# EAGLE design Grove - Node v1.0 (EAGLE 7.1.0)

## Sheet 1 of 2
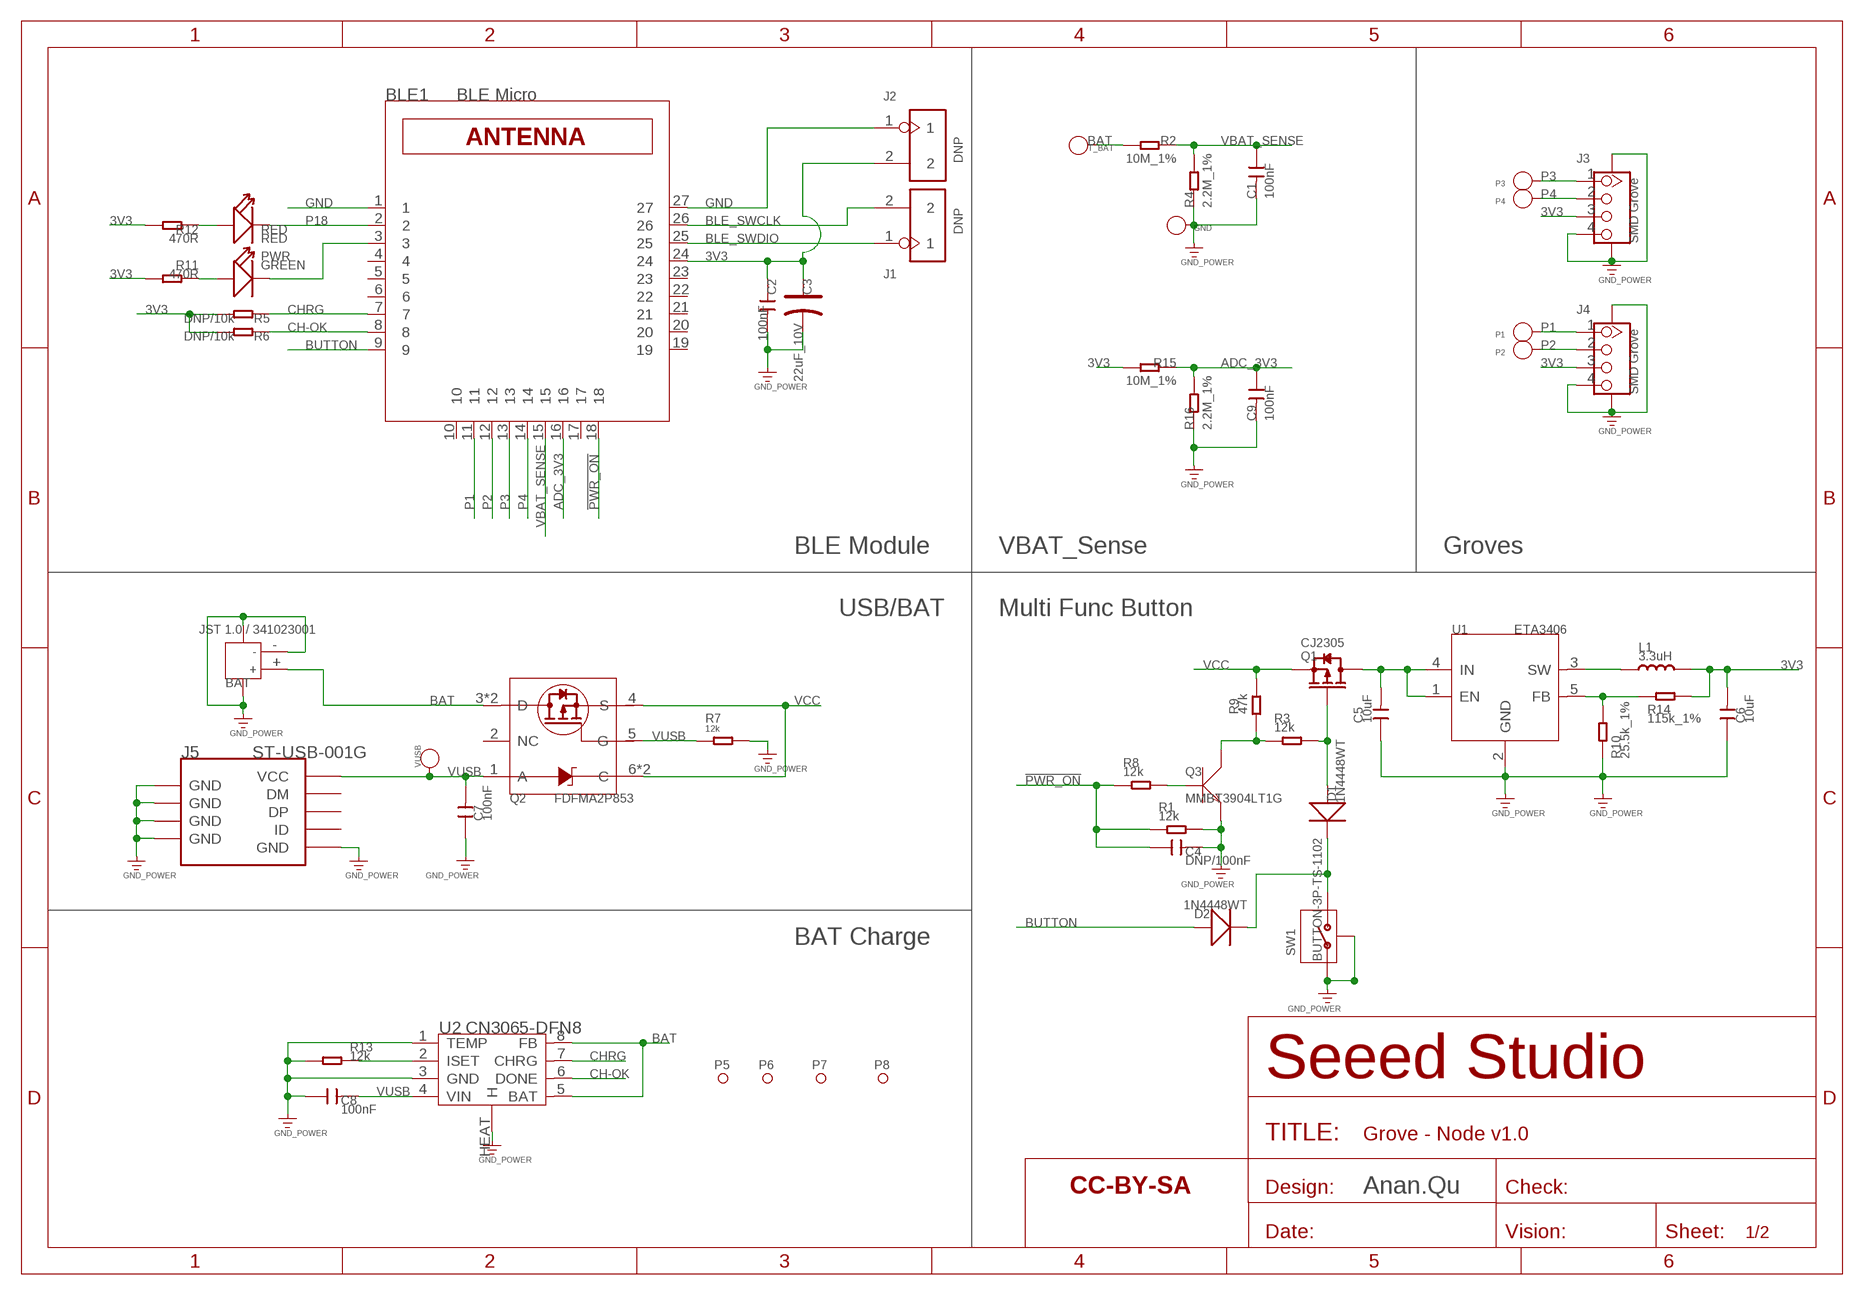
[diagram p0: schematic, sheet 1]

### Parts
BAT  JST 1.0 / 341023001  JACK-JST-2P-SMD-PW'1.0'  [JST-SMD-2P-1.0-90D]
BLE1  BLE Micro  SEEED_BLE_MODULE_001'PAD'  [SEEED_BLE_MODULE_PAD]
C1  100nF  C-0402  [C0402]
C2  100nF  C-0402  [C0402]
C3  22uF_10V  CAP-AVX-A  [AVX-A]
C4  DNP/100nF  C-0402  [C0402]
C5  10uF  C-0805  [C0805]
C6  10uF  C-0805  [C0805]
C7  100nF  C-0402  [C0402]
C8  100nF  C-0402  [C0402]
C9  100nF  C-0402  [C0402]
D1  1N4448WT  D'0603'  [SOD523]
D2  1N4448WT  D'0603'  [SOD523]
GND  PAD-TEST-POINT'4545'  [TP_4545]
J1  DNP  HEADER-2P-2.0  [2P-2.0-55/32MIL]
J2  DNP  HEADER-2P-2.0  [2P-2.0-55/32MIL]
J3  SMD Grove  GROVE-CONNECTOR-SMD'DD'  [4P-SMD-2.0]
J4  SMD Grove  GROVE-CONNECTOR-SMD'DD'  [4P-SMD-2.0]
J5  ST-USB-001G  USB-MINIUSB-5P-MICRO  [MICRO-USB]
L1  3.3uH  L'SLW3015S220MST'  [L3015]
P1  PAD-TEST-POINT'4545'  [TP_4545]
P2  PAD-TEST-POINT'4545'  [TP_4545]
P3  PAD-TEST-POINT'4545'  [TP_4545]
P4  PAD-TEST-POINT'4545'  [TP_4545]
P5  PAD-MARK'ANNULAR'  [ROUND-MARK-1.0]
P6  PAD-MARK'ANNULAR'  [ROUND-MARK-1.0]
P7  PAD-MARK'ANNULAR'  [ROUND-MARK-1.0]
P8  PAD-MARK'ANNULAR'  [ROUND-MARK-1.0]
PWR  GREEN  LED'0402'  [LED-0402]
Q1  CJ2305  MOSFET-P'SI2323CDS/SI2305DS<BR>'  [SOT23]
Q2  FDFMA2P853  [6P-SMD-W/-HEAT]
Q3  MMBT3904LT1G  TRANSISTOR-NPN-SOT23  [SOT-23]
R1  12k  R-0402  [R0402]
R2  10M_1%  R-0402  [R0402]
R3  12k  R-0402  [R0402]
R4  2.2M_1%  R-0402  [R0402]
R5  DNP/10k  R-0402  [R0402]
R6  DNP/10k  R-0402  [R0402]
R7  12k  R-0402  [R0402]
R8  12k  R-0402  [R0402]
R9  47k  R-0402  [R0402]
R10  25.5k_1%  R-0402  [R0402]
R11  470R  R-0402  [R0402]
R12  470R  R-0402  [R0402]
R13  12k  R-0402  [R0402]
R14  115k_1%  R-0402  [R0402]
R15  10M_1%  R-0402  [R0402]
R16  2.2M_1%  R-0402  [R0402]
RED  RED  LED'0402'  [LED-0402]
SW1  BUTTON-3P-TS-1102  [3P-1.5-L4.5*W2.9*H4.5-2.8MM]
T_BAT  PAD-TEST-POINT'4545'  [TP_4545]
U1  ETA3406  [SOT23-5]
U2  CN3065-DFN8  [DFN8]
U$4  SEEEDSTUDIO-OPEN-SCH-FRAME  [SEEEDSTUDIO-PCB-FRAME]
VUSB  PAD-TEST-POINT'4545'  [TP_4545]

### Nets
3V3: BLE1.24 C2.1 C3.+ C6.2 J2.2 J3.3 J4.3 L1.2 R5.2 R6.2 R11.2 R12.2 R14.1 R15.2
!PWR_ON: BLE1.18 C4.1 R1.2 R8.2
ADC_3V3: BLE1.16 C9.1 R15.1 R16.2
BAT: BAT.+ Q2.3(D) Q2.P2(D) R2.2 T_BAT.T U2.5(BAT) U2.8(FB)
BLE_SWCLK: BLE1.26 J1.2
BLE_SWDIO: BLE1.25 J1.1
BUTTON: BLE1.9 D2.+
CH-OK: BLE1.8 R6.1 U2.6(DONE)
CHRG: BLE1.7 R5.1 U2.7(CHRG)
GND: BAT.3 BAT.4 BAT.- BLE1.1 BLE1.27 C1.2 C2.2 C3.- C4.2 C5.1 C6.1 C7.1 C8.1 C9.2 GND.T J2.1 J3.4 J3.SS1 J3.SS2 J4.4 J4.SS1 J4.SS2 J5.5(GND) J5.S1(GND) J5.S2(GND) J5.S3(GND) J5.S4(GND) J5.S5(GND) J5.S6(GND) Q3.2(E) R1.1 R4.1 R7.2 R10.2 R13.1 R16.1 SW1.1 SW1.3(GND) U1.2(GND) U2.1(TEMP) U2.3(GND) U2.HEAT(H) ; supply symbol labelled GND_POWER
ISET: R13.2 U2.2(ISET)
N$1: PWR.+ R11.1
N$2: R12.1 RED.+
N$3: L1.1 U1.3(SW)
N$4: R10.1 R14.2 U1.5(FB)
N$5: Q3.3(C) R3.2 R9.1
N$6: D1.- D2.- SW1.2
N$7: Q3.1(B) R8.1
N$8: C5.2 Q1.3(D) U1.1(EN) U1.4(IN)
N$11: D1.+ Q1.1(G) R3.1
P1: BLE1.11 J4.1 P1.T
P2: BLE1.12 J4.2 P2.T
P3: BLE1.13 J3.1 P3.T
P4: BLE1.14 J3.2 P4.T
P5: BLE1.3 PWR.-
P18: BLE1.2 RED.-
VBAT_SENSE: BLE1.15 C1.1 R2.1 R4.2
VCC: Q1.2(S) Q2.4(S) Q2.6(C) Q2.P1(C) R9.2
VUSB: C7.2 C8.2 J5.1(VCC) Q2.1(A) Q2.5(G) R7.1 U2.4(VIN) VUSB.T
Unconnected: BLE1.4 BLE1.5 BLE1.6 BLE1.10 BLE1.17 BLE1.19 BLE1.20 BLE1.21 BLE1.22 BLE1.23 J5.2(DM) J5.3(DP) J5.4(ID) Q2.2(NC)

### Notes on the sheet
- BLE Module | VBAT_Sense | Groves
- USB/BAT | Multi Func Button
- BAT Charge
- Anan.Qu

## Sheet 2 of 2

## Library data of the parts
BAT = Connector :JACK-JST-2P-SMD-PW
BLE1 = AMLib:SEEED_BLE_MODULE_001
C1 C2 C4-C9 = Discrete:C*: Ceramic Capacitors
C3 = Discrete:CAP*: Electrolytic Capacitors,Tantalum Capacitors and Super Capacitors
D1 D2 = Discrete:D*
GND P1-P4 T_BAT VUSB = Discrete:PAD-TEST-POINT; PARTNO: DNP
J1 J2 = Connector-new:HEADER-2P
J3 J4 = Connector-new:GROVE-CONNECTOR-SMD: 4P-SMD-2.0:320110030;4P-SMD-2.0-90D:320110032
J5 = Connector :USB-MINIUSB-5P
L1 = template:L
P5-P8 = Discrete-new:PAD-MARK; PARTNO: DNP
PWR RED = Discrete:LED*
Q1 = Discrete:MOSFET-P
Q2 = template:FDFMA2P853: Integrated P-Channel Power Trench MOSFET and Schottky Diode
Q3 = Discrete-new:TRANSISTOR-NPN*: NPN audion
R1-R16 = Discrete:R*
SW1 = Discrete-new:BUTTON-3P-TS-1102
U1 = template:ETA3406: 1.5MHZ 1.2A Step-Down Converter in SOT23-5 Package
U2 = IC:CN3065: USB-Compatible Lithiumt-Ion Battery Charger with Thermal Regulation http://www.consonance-elec.com/pdf/%E6%8A%80%E6%9C%AF%E8%AF%B4%E6%98%8E%E4%B9%A6/DSC-CN3065.pdf
U$4 = moudle-new:SEEEDSTUDIO-OPEN-SCH-FRAME

## Net classes
0 default: width 0.102 mm, drill 0.203 mm, clearance 0.102 mm

## Board
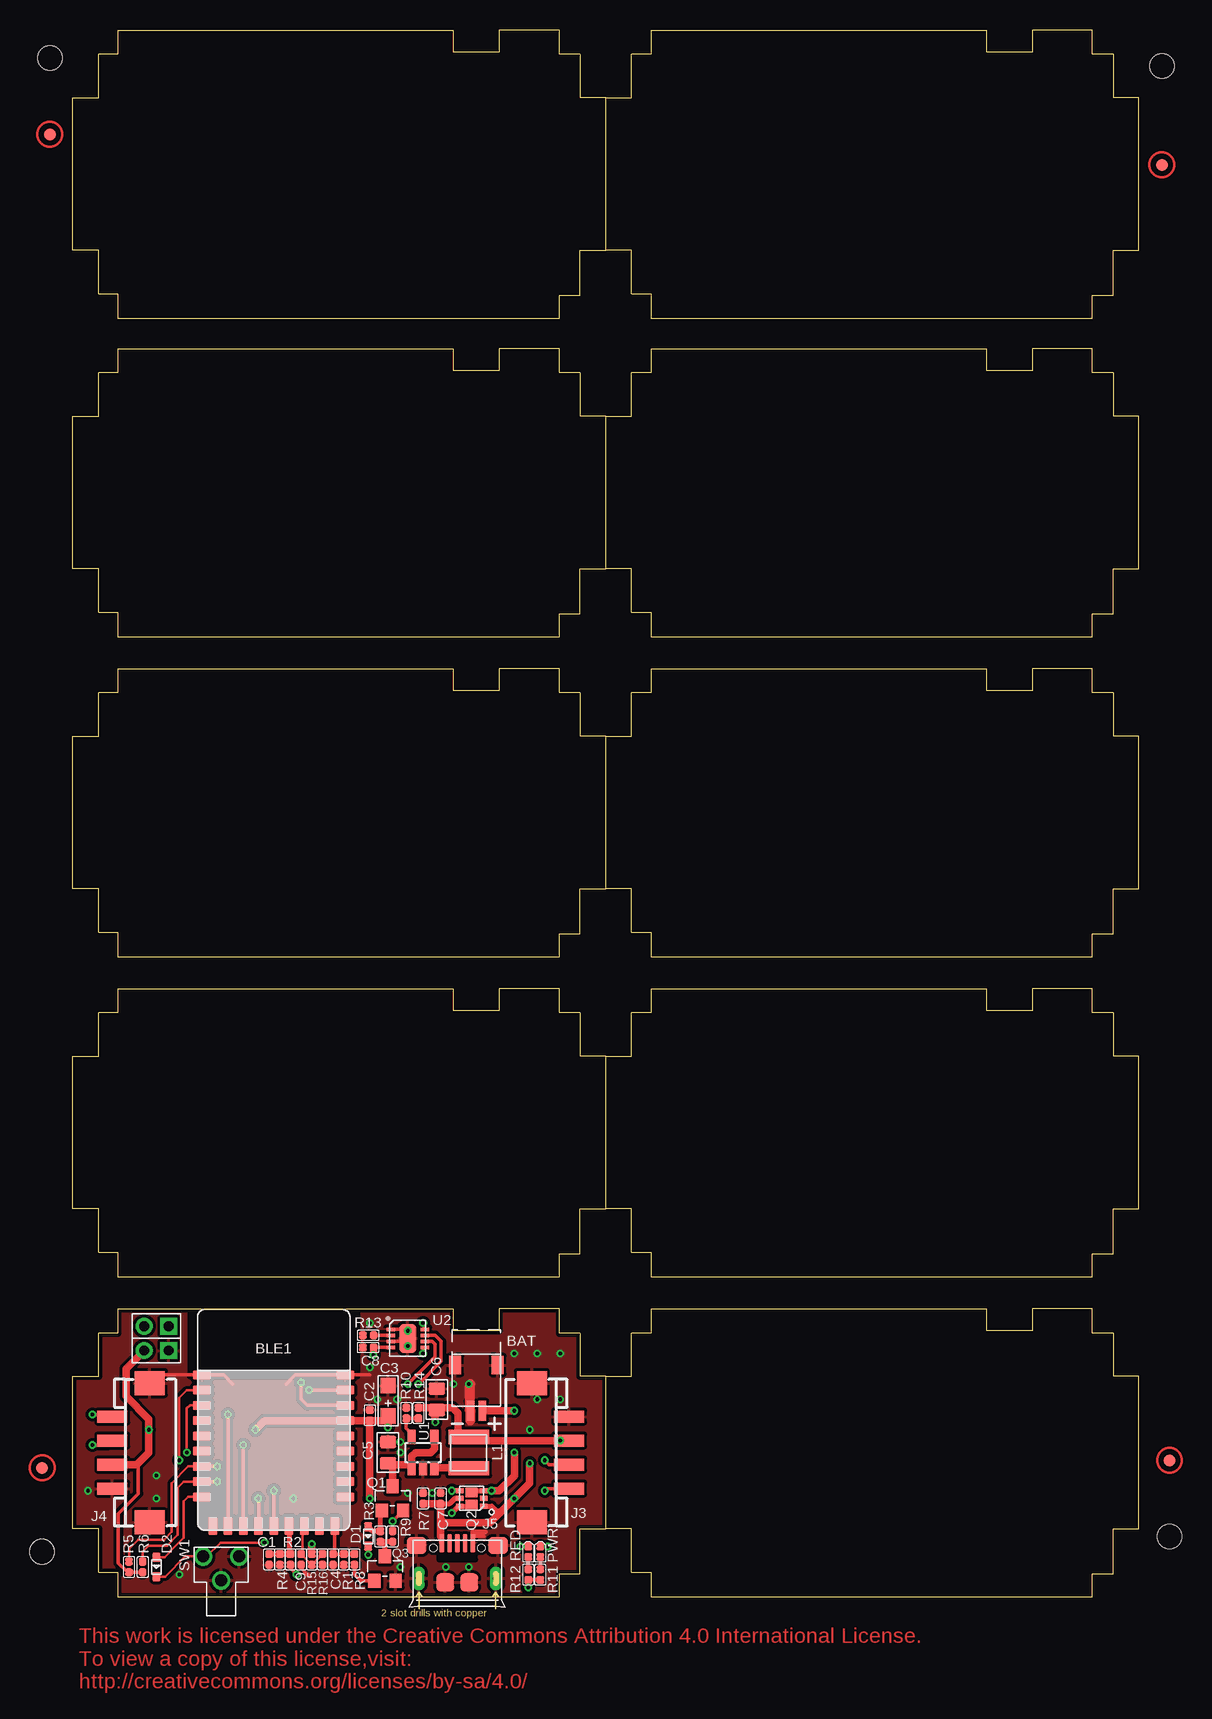
[diagram p1: board, top side]
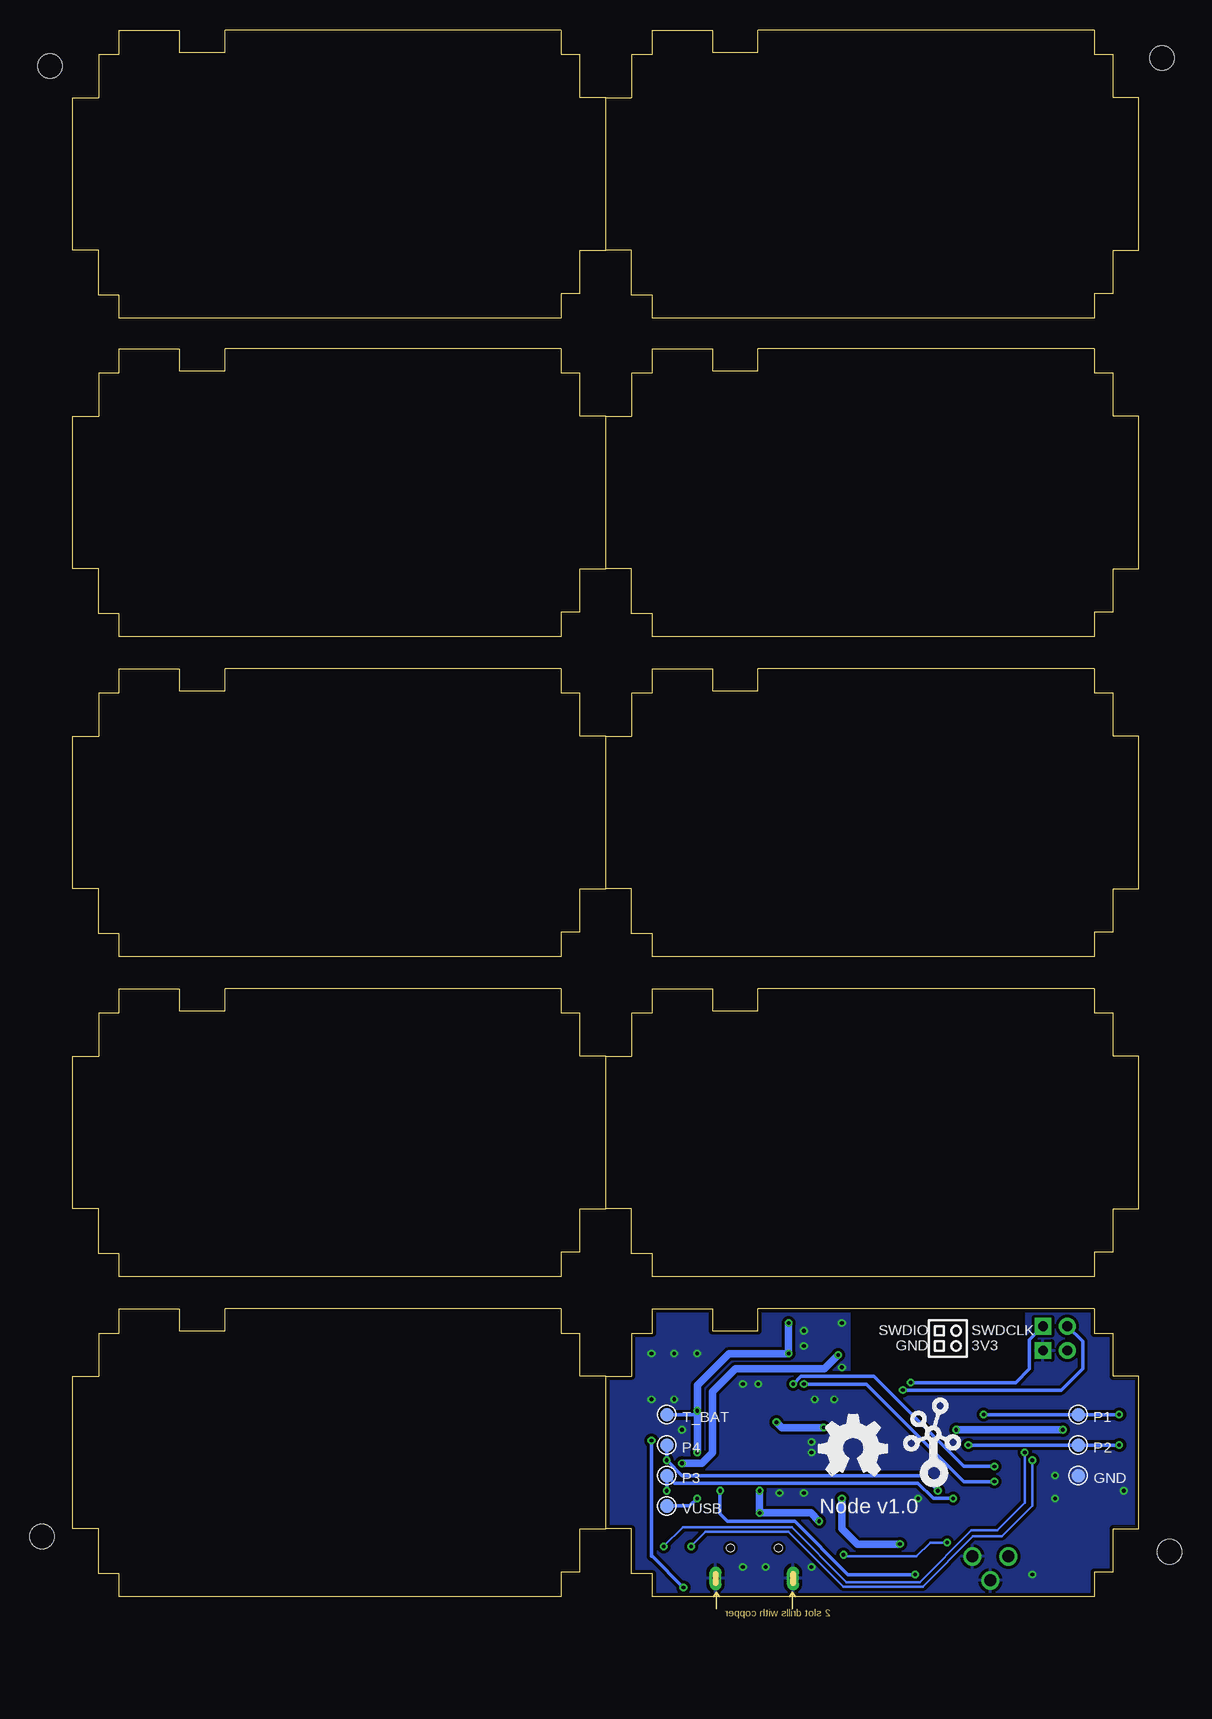
[diagram p2: board, bottom side, seen from below]

Size 88.9 x 130.56 mm. Coordinates in mm from the lower left corner, seen from the top.
Outline: 44.45,5.65 42.29,5.65 42.29,1.9 40.58,1.9 40.58,0 3.75,0 3.75,2.03 2.16,2.03 2.16,5.65 0,5.65 0,18.35 2.16,18.35 2.16,21.97 3.75,21.97 3.75,24 31.75,24 31.75,22.16 35.56,22.16 35.56,24 40.58,24 40.58,21.97 42.29,21.97 42.29,18.35 44.45,18.35
Outline: 44.45,5.65 46.61,5.65 46.61,2.03 48.2,2.03 48.2,0 85.03,0 85.03,1.9 86.74,1.9 86.74,5.65 88.9,5.65 88.9,18.35 86.74,18.35 86.74,21.97 85.03,21.97 85.03,24 80.01,24 80.01,22.16 76.2,22.16 76.2,24 48.2,24 48.2,21.97 46.61,21.97 46.61,18.35 44.45,18.35
Outline: 44.45,5.65 44.45,18.35
Outline: 44.45,32.32 42.29,32.32 42.29,28.57 40.58,28.57 40.58,26.67 3.75,26.67 3.75,28.7 2.16,28.7 2.16,32.32 0,32.32 0,45.02 2.16,45.02 2.16,48.64 3.75,48.64 3.75,50.67 31.75,50.67 31.75,48.83 35.56,48.83 35.56,50.67 40.58,50.67 40.58,48.64 42.29,48.64 42.29,45.02 44.45,45.02
Outline: 44.45,32.32 46.61,32.32 46.61,28.7 48.2,28.7 48.2,26.67 85.03,26.67 85.03,28.57 86.74,28.57 86.74,32.32 88.9,32.32 88.9,45.02 86.74,45.02 86.74,48.64 85.03,48.64 85.03,50.67 80.01,50.67 80.01,48.83 76.2,48.83 76.2,50.67 48.2,50.67 48.2,48.64 46.61,48.64 46.61,45.02 44.45,45.02
Outline: 44.45,32.32 44.45,45.02
Outline: 44.45,58.99 42.29,58.99 42.29,55.24 40.58,55.24 40.58,53.34 3.75,53.34 3.75,55.37 2.16,55.37 2.16,58.99 0,58.99 0,71.69 2.16,71.69 2.16,75.31 3.75,75.31 3.75,77.34 31.75,77.34 31.75,75.5 35.56,75.5 35.56,77.34 40.58,77.34 40.58,75.31 42.29,75.31 42.29,71.69 44.45,71.69
Outline: 44.45,58.99 46.61,58.99 46.61,55.37 48.2,55.37 48.2,53.34 85.03,53.34 85.03,55.24 86.74,55.24 86.74,58.99 88.9,58.99 88.9,71.69 86.74,71.69 86.74,75.31 85.03,75.31 85.03,77.34 80.01,77.34 80.01,75.5 76.2,75.5 76.2,77.34 48.2,77.34 48.2,75.31 46.61,75.31 46.61,71.69 44.45,71.69
Outline: 44.45,58.99 44.45,71.69
Outline: 44.45,85.66 42.29,85.66 42.29,81.91 40.58,81.91 40.58,80.01 3.75,80.01 3.75,82.04 2.16,82.04 2.16,85.66 0,85.66 0,98.36 2.16,98.36 2.16,101.98 3.75,101.98 3.75,104.01 31.75,104.01 31.75,102.17 35.56,102.17 35.56,104.01 40.58,104.01 40.58,101.98 42.29,101.98 42.29,98.36 44.45,98.36
Outline: 44.45,85.66 46.61,85.66 46.61,82.04 48.2,82.04 48.2,80.01 85.03,80.01 85.03,81.91 86.74,81.91 86.74,85.66 88.9,85.66 88.9,98.36 86.74,98.36 86.74,101.98 85.03,101.98 85.03,104.01 80.01,104.01 80.01,102.17 76.2,102.17 76.2,104.01 48.2,104.01 48.2,101.98 46.61,101.98 46.61,98.36 44.45,98.36
Outline: 44.45,85.66 44.45,98.36
Outline: 44.45,112.2 42.29,112.2 42.29,108.46 40.58,108.46 40.58,106.55 3.75,106.55 3.75,108.59 2.16,108.59 2.16,112.2 0,112.2 0,124.9 2.16,124.9 2.16,128.52 3.75,128.52 3.75,130.56 31.75,130.56 31.75,128.71 35.56,128.71 35.56,130.56 40.58,130.56 40.58,128.52 42.29,128.52 42.29,124.9 44.45,124.9
Outline: 44.45,112.2 46.61,112.2 46.61,108.59 48.2,108.59 48.2,106.55 85.03,106.55 85.03,108.46 86.74,108.46 86.74,112.2 88.9,112.2 88.9,124.9 86.74,124.9 86.74,128.52 85.03,128.52 85.03,130.56 80.01,130.56 80.01,128.71 76.2,128.71 76.2,130.56 48.2,130.56 48.2,128.52 46.61,128.52 46.61,124.9 44.45,124.9
Outline: 44.45,112.2 44.45,124.9
Copper layers (1*16): Top 0.035mm / dielectric 1.5mm / Bottom 0.035mm
Design rules "SeeedStudio_2layer_DRU_no_angle_20140221 *": minimum track width 6mil, minimum drill 12mil, track to track 6mil, track to pad 6mil, pad to pad 6mil, via to via 6mil, smd to smd 0mil, copper to edge 10mil, drill to drill 10mil, minimum pad ring 10mil, minimum via ring 6mil, stop-mask expansion 2mil, vias tented up to drill 100mil, thermal gap 10mil
Holes 2.03 mm at -1.9,128.21 90.81,127.57 91.44,5.02 -2.54,3.75
tRestrict: area 9.8,18.4 to 23.7,23.9
bRestrict: area 9.8,18.4 to 23.7,23.9

### Footprints (pad centres in the part's own frame; a part is rotated, then mirrored left to right if it is on the bottom)
JST-SMD-2P-1.0-90D = smd 1.524 x 1.016: 3 -3.429,1.778; 4 -3.429,-1.778 | smd 1.651 x 0.635: + 0.381,0.508; - 0.381,-0.508
SEEED_BLE_MODULE_PAD = smd 1.524 x 0.762: 1 -5.969,12.954; 2 -5.969,11.684; 3 -5.969,10.414; 4 -5.969,9.144; 5 -5.969,7.874; 6 -5.969,6.604; 7 -5.969,5.334; 8 -5.969,4.064; 9 -5.969,2.794; 19 5.969,2.794; 20 5.969,4.064; 21 5.969,5.334; 22 5.969,6.604; 23 5.969,7.874; 24 5.969,9.144; 25 5.969,10.414; 26 5.969,11.684; 27 5.969,12.954 | smd 0.762 x 1.524: 10 -5.08,0.381; 11 -3.81,0.381; 12 -2.54,0.381; 13 -1.27,0.381; 14 0,0.381; 15 1.27,0.381; 16 2.54,0.381; 17 3.81,0.381; 18 5.08,0.381
C0402 = smd 0.635 x 0.635: 1 -0.445,0; 2 0.445,0
AVX-A = smd 1.27 x 1.27: + -1.27,0; - 1.27,0
C0805 = smd 1.016 x 1.397: 1 -0.889,0; 2 0.889,0
SOD523 = smd 0.762 x 0.7: + -0.8,0; - 0.8,0
TP_4545 = smd 1.143 x 1.143: T 0,0
2P-2.0-55/32MIL = drill 0.813 pad 1.397 square: 1 -1.016,0 | drill 0.813 pad 1.397: 2 1.016,0
4P-SMD-2.0 = smd 1 x 2.5: 1 -3,0; 2 -1,0; 3 1,0; 4 3,0 | smd 2 x 2.5: SS1 -5.8,3.123; SS2 5.8,3.123
MICRO-USB = smd 0.381 x 1.524: 1 -1.3,-0.25; 2 -0.65,-0.25; 3 0,-0.25; 4 0.65,-0.25; 5 1.3,-0.25 | smd 1.6 x 1.397: S1 -3.4,-0.427; S6 3.4,-0.427 | drill 0.508 pad 1.016 long: S2 -3.226,-3.175; S5 3.226,-3.175 | smd 1.5 x 1.5: S3 -1,-3.5; S4 1,-3.5 | hole 0.635: -2,-0.65; 2,-0.65
L3015 = smd 1.2 x 3.4: 1 -1.3,0; 2 1.3,0
ROUND-MARK-1.0 = smd 1.016 x 1.016: P$1 0,0
LED-0402 = smd 0.635 x 0.635: + -0.445,0; - 0.445,0
SOT23 = smd 1.016 x 1.143: 1 -0.889,-1.016; 2 0.889,-1.016; 3 0,1.016
6P-SMD-W/-HEAT = smd 0.42 x 0.62: 1 -0.65,-1.015; 2 0,-1.015; 3 0.65,-1.015; 4 0.65,1.015; 5 0,1.015; 6 -0.65,1.015 | smd 0.8 x 1: P1 -0.508,0; P2 0.5,0
SOT-23 = smd 1.016 x 1.143: 1 -0.889,-1.016; 2 0.889,-1.016; 3 0,1.016
R0402 = smd 0.635 x 0.635: 1 -0.445,0; 2 0.445,0
3P-1.5-L4.5*W2.9*H4.5-2.8MM = drill 1 pad 1.5: 1 -1.5,-1; 2 1.5,-1; 3 0,1
SOT23-5 = smd 0.69 x 1.2: 1 -0.95,-1.3; 2 0,-1.3; 3 0.95,-1.3; 4 0.95,1.3; 5 -0.95,1.3
DFN8 = smd 0.3 x 0.727: 1 -0.75,-1.413; 2 -0.25,-1.413; 3 0.25,-1.413; 4 0.75,-1.413; 5 0.75,1.413; 6 0.25,1.413; 7 -0.25,1.413; 8 -0.75,1.413 | smd 2.413 x 1.397: HEAT 0,0

### Placement (x,y rotation side)
BAT  33.66,15.88 270 top
BLE1  16.76,5.52 0 top
C1  16.38,3.11 270 top
C2  24.77,15.11 90 top
C3  26.29,16.32 90 top
C4  21.72,3.11 270 top
C5  26.29,12 270 top
C6  30.35,16.45 270 top
C7  30.67,8.19 270 top
C8  24.64,20.76 0 top
C9  19.05,3.11 270 top
D1  24.64,5.02 270 top
D2  6.99,2.48 270 top
GND  5.08,10.1 0 bottom
J1  6.99,22.54 180 top
J2  6.99,20.51 180 top
J3  41.4,12 90 top
J4  3.3,12 270 top
J5  32.07,4.7 0 top
L1  33.02,12 90 top
P1  5.08,15.18 270 bottom
P2  5.08,12.64 270 bottom
P3  39.37,10.1 270 bottom
P4  39.37,12.64 270 bottom
P5  -2.54,10.73 0 top
P6  91.44,11.37 0 top
P7  -1.9,121.86 0 top
P8  90.81,119.32 0 top
PWR  38.99,3.75 90 top
Q1  26.67,8.19 0 top
Q2  33.27,8.19 90 top
Q3  26.04,2.35 0 top
R1  22.61,3.11 90 top
R2  18.16,3.11 270 top
R3  25.65,5.02 270 top
R4  17.27,3.11 90 top
R5  4.7,2.48 270 top
R6  5.84,2.48 270 top
R7  29.21,8.19 90 top
R8  23.5,3.11 90 top
R9  26.67,5.02 90 top
R10  27.81,15.3 90 top
R11  38.99,1.84 270 top
R12  37.97,1.84 270 top
R13  24.64,21.78 0 top
R14  28.83,15.3 270 top
R15  19.94,3.11 90 top
R16  20.83,3.11 90 top
RED  37.97,3.75 90 top
SW1  12.38,2.35 180 top
T_BAT  39.37,15.18 270 bottom
U1  29.21,12 0 top
U2  27.94,21.53 270 top
U$2  [OSHW_FILLX200_NOTEXT]  26.67,10.1 0 bottom
U$3  [TWIGLOGO]  17.15,10.1 0 bottom
U$4  0.51,-7.68 0 top  (outside the outline)
VUSB  39.37,7.56 270 bottom

### Tracks (layer width: path | path; a pad name or v marks a point on that pad's centre or on a via)
3V3  (via drill 0.3 pad 0.64)
  Top 0.305: R11.2 R12.2 v37.97,0.76 | R6.2 R5.2 4.57,2.16 4.45,2.16 3.81,2.79 3.81,6.92 5.48,8.59 5.48,11.1 5.46,11.11
  Top 0.61: C2.1 26.29,14.67 C3.+ v26.29,14.1 | J3.3 v40.64,13 33.19,13 32.89,13.3 | C2.1 BLE1.24 16,14.67 v15.24,13.91 | C2.1 v24.77,8.19 | J2.2 4.45,18.99 4.45,16.7 6.35,14.8 v6.35,13.91 6.35,12 5.46,11.11 5.35,11 J4.3 | R14.1 30.16,15.75 | 30.16,15.75 C6.2 | L1.2 32.89,13.3 | 32.89,13.3 32.13,13.3 | 32.13,13.3 31.65,13.3 31.62,13.27 | 30.61,15.56 C6.2 | v30.23,14.54 30.23,15.43 C6.2 | 30.16,15.75 31.69,15.75 32.13,15.3 32.13,13.3 | R15.2 v19.94,4.38
  Bottom 0.305: v40.64,13 40.64,3.37 40.58,3.37 v37.97,0.76
  Bottom 0.61: v15.24,13.91 v6.35,13.91 | v26.29,14.1 29.78,14.1 v30.23,14.54 | v19.94,4.38 23.5,4.38 24.77,5.65 v24.77,8.19
!PWR_ON
  Top 0.305: BLE1.18 21.84,3.56 | C4.1 21.84,3.56 | 21.84,3.56 R1.2 R8.2
ADC_3V3
  Top 0.152: C9.1 R15.1 R16.2
  Top 0.203: C9.1 19.11,3.56 19.18,3.62 19.18,5.78 BLE1.16
BAT  (via drill 0.3 pad 0.64)
  Top 0.305: U2.5 29.35,20.4 v29.21,20.26 | U2.8 29.35,22.65 v29.21,22.8 | R2.2 18.16,2.35 v18.67,1.84
  Top 0.406: Q2.P2 33.42,8.84 Q2.3 34.91,8.84 v34.92,8.83
  Top 0.61: v34.92,8.83 35.56,8.83 36.83,10.1 v36.83,12 | BAT.+ v36.83,15.49
  Bottom 0.305: v34.92,8.83 34.92,6.92 34.29,6.29 28.7,6.29 24.26,1.84 v18.67,1.84 | T_BAT.T 37.15,15.18 v36.83,15.49
  Bottom 0.61: v29.21,22.8 v29.21,20.26 34.18,20.26 36.83,17.6 v36.83,15.49 v36.83,12
BLE_SWCLK  (via drill 0.3 pad 0.64)
  Top 0.305: BLE1.26 v19.69,17.21
  Bottom 0.305: v19.69,17.21 6.48,17.21 4.7,18.99 4.7,21.27 J1.2
BLE_SWDIO  (via drill 0.3 pad 0.64)
  Top 0.305: BLE1.25 19.56,15.94 19.05,16.45 v19.05,17.84
  Bottom 0.305: v19.05,17.84 10.29,17.84 9.14,18.99 9.14,21.4 J1.1
BUTTON
  Top 0.203: BLE1.9 9.65,8.32 9.27,7.94 9.27,4.89 8.19,3.81 8.13,3.75 7.66,3.28 D2.+
CH-OK  (via drill 0.3 pad 0.64)
  Top 0.203: BLE1.8 9.27,9.59 8.76,9.08 8.76,5.14 7.87,4.25 6.35,4.25 5.84,3.75 R6.1
  Top 0.305: BLE1.8 v12.07,9.59 | U2.6 29.97,21.28 30.23,21.02 30.23,20 v27.94,17.72
  Bottom 0.305: v12.07,9.59 14.61,9.59 22.73,17.72 v27.94,17.72
CHRG  (via drill 0.3 pad 0.64)
  Top 0.203: BLE1.7 9.65,10.86 8.26,9.46 8.26,5.4 7.62,4.76 5.46,4.76 4.7,4 R5.1
  Top 0.305: BLE1.7 v12.07,10.86 | U2.7 30.23,21.78 30.73,21.27 30.73,19.62 v28.83,17.72
  Bottom 0.305: v12.07,10.86 14.61,10.86 22.1,18.35 28.19,18.35 v28.83,17.72
GND  (via drill 0.3 pad 0.64)
  Top 0.305: J5.5 33.37,4.59 33.37,4.98 33.4,5.02 34.29,5.02 | U2.3 27.94,21.28 | 13.34,17.72 12.57,18.48 BLE1.1 6.86,18.48 6.73,18.35 6.73,18.11 J4.SS1 | 17.78,17.72 18.54,18.48 BLE1.27 24.77,18.48 | U2.1 27.93,22.28 27.94,22.29 27.94,21.28 | 27.94,21.02 27.94,21.28 | C9.2 19.05,2.35 19.56,1.84 19.69,1.84 19.81,1.71
  Top 0.406: 33.37,4.59 33.37,5.4 34.42,5.4
  Top 0.813: 33.15,17.72 BAT.- 33.15,14.67
  other vias: 29.97,8.64 27.94,8.64 27.94,22.16 27.94,20.89 24.77,19.11 40.64,16.45 18.42,8.19 27.3,2.48 40.64,20.26 25.4,16.45 27.05,16.45 33.02,17.72 31.75,17.72 38.1,13.91 38.73,16.45 27.3,12.89 27.3,12 24.77,22.8 6.99,10.1 6.99,8.19 1.27,8.83 8.89,1.84 33.02,2.48 31.12,2.48 36.83,20.26 38.73,20.26
  pour Bottom (isolate 0.254): 0,24.07 44.45,24.07 44.45,-0.06 0,-0.06
  pour Top (isolate 0.254): 0,24.07 44.45,24.07 44.45,-0.06 0,-0.06
ISET
  Top 0.305: U2.2 R13.2
N$1
  Top 0.305: PWR.+ R11.1
N$2
  Top 0.305: RED.+ R12.1
N$3
  Top 0.61: U1.3 30.2,10.7 30.23,10.73 32.99,10.73 L1.1
N$4
  Top 0.305: R14.2 R10.1 27.81,14.03 28.07,13.78 28.07,13.49 U1.5
N$5
  Top 0.406: R9.1 26.04,4.57 | 26.04,4.57 R3.2 | Q3.3 26.04,4.57
N$6  (via drill 0.3 pad 0.64)
  Top 0.203: 6.99,1.71 D2.- 7.71,1.68 9.4,3.37 10.87,3.37 | 10.87,3.37 SW1.2 | 10.87,3.37 11.18,3.37 12.32,4.51 v16,4.51
  Top 0.305: 24.47,4.38 D1.- v24.64,3.49
  Bottom 0.203: v16,4.51 17.4,4.51 18.54,3.37 24.51,3.37 v24.64,3.49
N$7
  Top 0.305: Q3.1 24,1.33 23.5,1.84 R8.1
N$8
  Top 0.152: C5.2 26.54,11.11 26.67,10.99
  Top 0.305: U1.1 28.26,10.92 28.19,10.99
  Top 0.61: Q1.3 26.67,10.99 28.19,10.99 | U1.1 28.26,11.69 28.58,12 29.85,12 30.16,12.32 U1.4
N$11
  Top 0.406: Q1.1 25.65,7.05 R3.1 24.99,5.46 D1.+
P1  (via drill 0.3 pad 0.64)
  Top 0.305: BLE1.11 v12.95,15.18 | v1.65,15.18 3.25,15.18 3.25,15.05 J4.1
  Bottom 0.305: v12.95,15.18 P1.T v1.65,15.18
P2  (via drill 0.3 pad 0.64)
  Top 0.305: BLE1.12 v14.22,12.64 | 3.83,13 3.7,13 3.68,13.02 3.81,13.02 3.7,13.13 3.3,13.13 3.25,13.07 | v1.65,12.64 3.06,12.64 3.06,12.89 3.25,13.07 | J4.2 3.3,13.02 3.25,13.07
  Bottom 0.305: v1.65,12.64 P2.T v14.22,12.64
P3  (via drill 0.3 pad 0.64)
  Top 0.305: v15.49,8.19 BLE1.13 | J3.1 39.55,9 v39.37,8.83
  Bottom 0.305: v39.37,8.83 P3.T 38.73,9.46 18.42,9.46 17.15,8.19 v15.49,8.19
P4  (via drill 0.3 pad 0.64)
  Top 0.305: v16.76,8.83 BLE1.14 | J3.2 39.73,11 v39.37,11.37
  Bottom 0.305: P4.T v39.37,11.37 38.1,10.1 37.47,10.1 36.2,10.1 18.03,10.1 v16.76,8.83
P5  (via drill 0.3 pad 0.64)
  Top 0.203: BLE1.3 9.78,15.94 9.53,15.68 v9.53,12
  Top 0.305: v39.62,4.19 PWR.-
  Bottom 0.203: v9.53,12 9.53,7.81 11.81,5.52 13.97,5.52 18.29,1.21 24.38,1.21 28.96,5.78 38.04,5.78 v39.62,4.19
P18  (via drill 0.3 pad 0.64)
  Top 0.203: v8.89,11.37 8.89,16.57 9.53,17.21 BLE1.2
  Top 0.305: v37.34,4.19 RED.-
  Bottom 0.203: v8.89,11.37 8.89,7.56 11.43,5.02 13.84,5.02 18.03,0.83 24.64,0.83 29.21,5.4 36.13,5.4 v37.34,4.19
VBAT_SENSE
  Top 0.406: C1.1 R4.2 R2.1 18.03,3.68 BLE1.15
VCC  (via drill 0.3 pad 0.64)
  Top 0.305: R9.2 v26.67,6.29 Q1.2
  Top 0.406: Q2.P1 33.13,7.54 Q2.6 32.18,7.54 v31.62,6.99 | Q2.4 31.64,8.84 v31.62,8.83
  Top 0.61: 27.75,6.99 Q1.2
  Bottom 0.61: v31.62,8.83 v31.62,6.99 27.37,6.99 v26.67,6.29
VUSB  (via drill 0.3 pad 0.64)
  Top 0.305: U2.4 25.09,20.78 C8.2
  Top 0.406: J5.1 30.77,5.17 30.67,5.27 | 30.67,7.68 30.1,7.68 30.04,7.75 R7.1 | Q2.5 31.88,8.19 31.43,7.75 C7.2 | Q2.1 34.94,7.54 35.31,7.18 | 35.31,7.18 35.56,6.92 | 35.31,7.18 35.69,7.18 35.31,6.79 | 35.31,7.18 35.31,6.79 | 35.31,6.67 35.31,6.79
  Top 0.61: 30.67,5.02 30.67,5.27 30.67,6.16 | 30.67,6.16 30.67,7.68 30.73,7.75 C7.2 R7.1 | 30.67,6.16 30.99,6.16 | 30.99,6.16 34.8,6.16 35.31,6.67 35.56,6.92 v36.83,8.19 38.1,9.46 v38.1,11.11 | 30.99,6.16 30.73,6.41 30.73,5.91 30.99,6.16 | C8.2 v25.08,20.13
  Bottom 0.305: VUSB.T 37.47,7.56 v36.83,8.19
  Bottom 0.61: v38.1,11.11 36.45,11.11 35.56,12 35.56,17.08 33.66,18.99 26.23,18.99 v25.08,20.13

### Text on the board
bPlace: SWDCLK | SWDIO | 3V3 | GND | Node v1.0